# Altium schematic sheet Sheet2.SchDoc
size A4; SheetNumber: 1; SheetTotal: 2
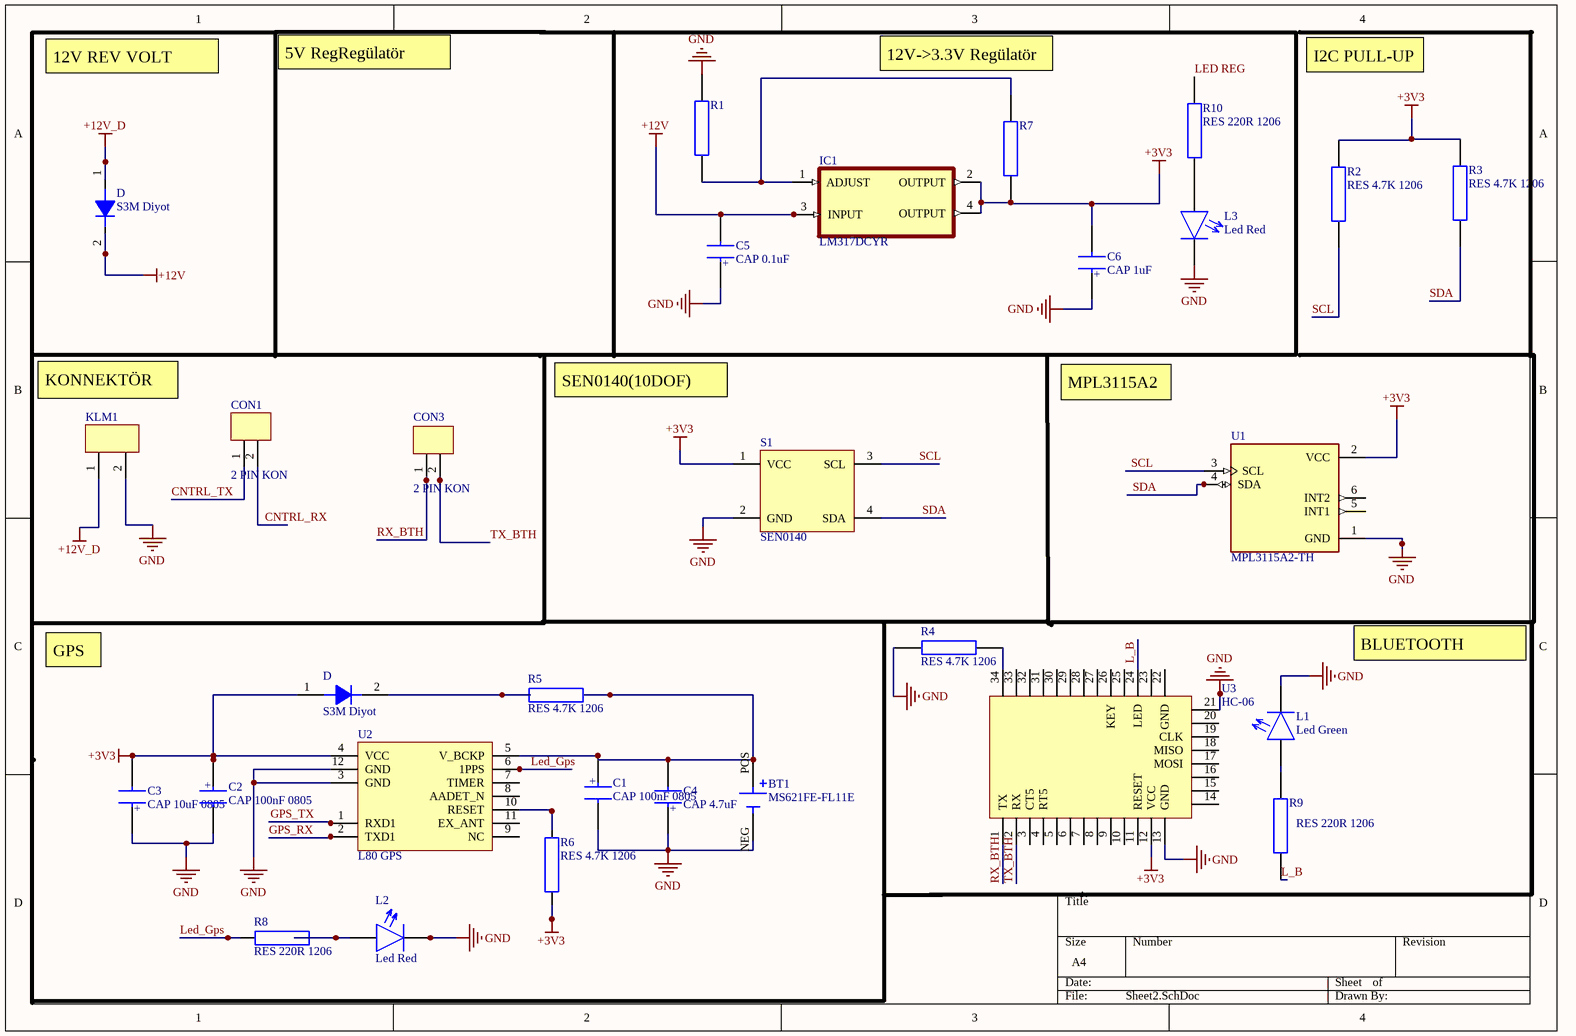
[diagram p0: Sheet2.SchDoc]

## Parts
(Parts that share a designator on the sheet are numbered #1, #2 ... from top to bottom, then left to right.)
BT1  MS621FE-FL11E  [BAT_MS621FE-FL11E]
C1  CAP 100nF 0805  [CAP_805]
C2  CAP 100nF 0805  [CAP_805]
C3  CAP 10uF 0805  [CAP_805]
C4  CAP 4.7uF  [CAP_805]
C5  CAP 0.1uF  [CAP_805]
C6  CAP 1uF  [CAP_805]
CON1  2 PIN KON  [2 PIN 2.54MM]
CON3  2 PIN KON  [2 PIN 2.54MM]
D#1  S3M Diyot  [DO214AA]
D#2  S3M Diyot  [DO214AA]
IC1  LM317DCYR  [SOT230P700X180-4N]
KLM1  2 Pin Klemens  [5.08mm-2 pin]  (value not drawn)
L1  Led Green  [Led 1206]
L2  Led Red  [Led 1206]
L3  Led Red  [Led 1206]
R1  RES 820R 1206  [RES_1206]  (value not drawn)
R2  RES 4.7K 1206  [RES_1206]
R3  RES 4.7K 1206  [RES_1206]
R4  RES 4.7K 1206  [RES_1206]
R5  RES 4.7K 1206  [RES_1206]
R6  RES 4.7K 1206  [RES_1206]
R7  RES 820R 1206  [RES_1206]  (value not drawn)
R8  RES 220R 1206  [RES_1206]
R9  RES 220R 1206  [RES_1206]
R10  RES 220R 1206  [RES_1206]
S1  SEN0140  [SEN0140]
U1  MPL3115A2-TH  [MPL3115A2]
U2  L80 GPS  [L-80]
U3  HC-06  [HC-06]

## Nets
+3V3: C2.1 C3.2 C6.2 D#2.1 IC1.2(OUTPUT) IC1.4(OUTPUT) R2.2 R3.2 R6.1 R7.2 S1.1(VCC) U1.2(VCC) U2.4(VCC) U3.12(VCC)
+12V: C5.2 D#1.2 IC1.3(INPUT)
+12V_D: D#1.1 KLM1.1
GND: BT1.NEG C1.2 C2.2 C3.1 C4.1 C5.1 C6.1 KLM1.2 L1.2 L2.2 L3.2 R1.2 R4.1 S1.2(GND) U1.1(GND) U2.3(GND) U2.12(GND) U3.13(GND) U3.21
CNTRL_RX: CON1.2
CNTRL_TX: CON1.1
GPS_RX: U2.2(TXD1)
GPS_TX: U2.1(RXD1)
L_B: R9.1 U3.24(LED)
LED REG: R10.2
Led_Gps: R8.1 U2.6(1PPS)
RX_BTH: CON3.1 U3.1(TX)
SCL: R2.1 S1.3(SCL) U1.3(SCL)
SDA: R3.1 S1.4(SDA) U1.4(SDA)
TX_BTH: CON3.2 U3.2(RX)
NetBT1_POS: BT1.POS C1.1 C4.2 R5.2 U2.5(V_BCKP)
NetD#2_2: D#2.2 R5.1
NetIC1_1: IC1.1(ADJUST) R1.1 R7.1
NetL1_1: L1.1 R9.2
NetL2_1: L2.1 R8.2
NetL3_1: L3.1 R10.1
NetR4_2: R4.2 U3.34
NetR6_2: R6.2 U2.10(RESET)

Not connected (* = marked no-connect by the designer): U1 5(INT1) 6(INT2); U2 7(TIMER) 8(AADET_N) 9(NC) 11(EX_ANT); U3 3(CT5) 4(RT5) 5 6 7 8 9 10 11(RESET) 14 15 16 17(MOSI) 18(MISO) 19(CLK) 20 22(GND) 23 25 26(KEY) 27 28 29 30 31 32 33

## Notes on the sheet
- 12V REV VOLT
- 5V RegRegülatör
- (near R7) 12V->3.3V Regülatör
- I2C PULL-UP
- KONNEKTÖR
- SEN0140(10DOF)
- MPL3115A2
- BLUETOOTH
- GPS
- (in symbol CAP 1uF) +
- (in symbol CAP 2.2uF) +
- (in symbol CAP 10uF 0805) +
- (in symbol CAP 100nF 0805) +

## Library data of the parts
BT1 = MS621FE-FL11E: Coin, 6.8mm 3V Lithium Battery Rechargeable (Secondary) 5.5mAh; MF: Seiko Instruments; SnapEDA_Link: https://www.snapeda.com/parts/MS621FE-FL11E/Seiko%20Instruments/view-part/6886595/?ref=snap; MP: MS621FE-FL11E; Availability: In Stock; Price: None; Check_prices: https://www.snapeda.com/parts/MS621FE-FL11E/Seiko%20Instruments/view-part/6886595/?ref=eda; Value: *; Purchase-URL: https://pricing.snapeda.com/search/part/MS621FE-FL11E/?ref=eda; Package: QFP-128 Seiko
C1 C2 = CAP 100nF 0805: 0805 smd
C3 = CAP 10uF 0805: 0805 smd
C4 = CAP 2.2uF: 0805 smd
C5 C6 = CAP 1uF: 0805 smd
CON1 CON3 = 2 PIN KON: 2.54 mm vertical
D#1 D#2 = S3M Diyot: Current: 3A; Voltage: 1000V; Case/Package: DO214AA
KLM1 = 2 Pin Klemens: 5.08mm 2 pin klemens
S1 = SEN0140: 10 DOF IMU
U2 = L80 GPS: Name: Quetcel L80; Designed By: Ahmet Azboy